# Altium schematic sheet 02_MCU.SchDoc
size A4
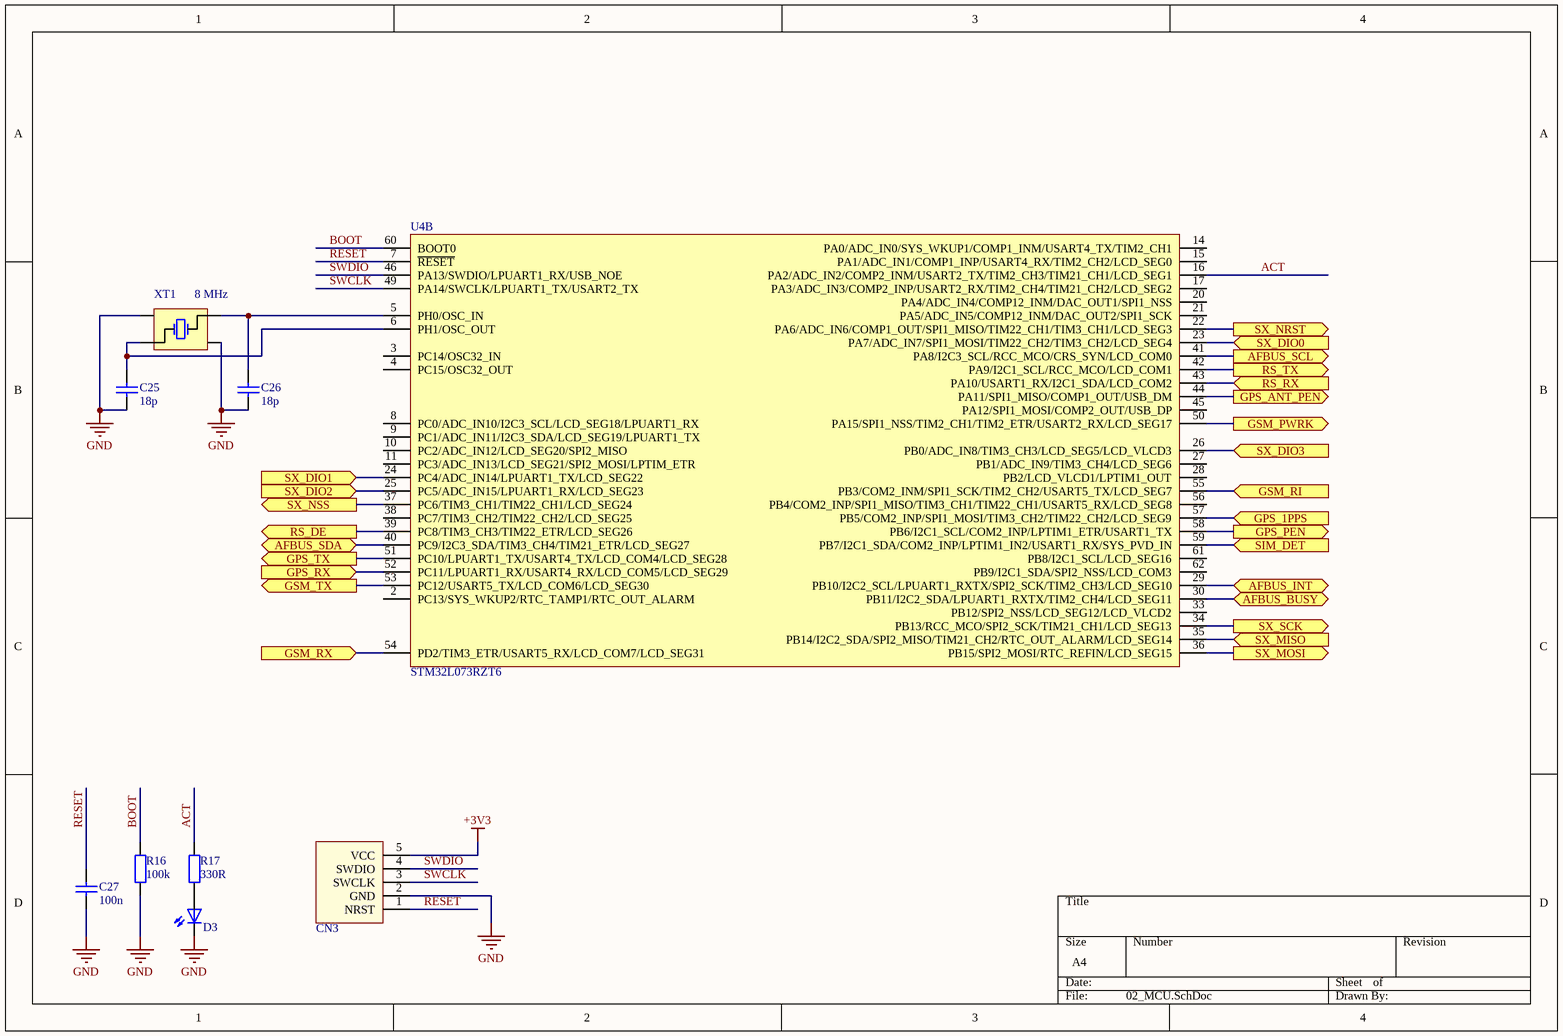
[diagram p0: 02_MCU.SchDoc]

## Parts
C25  18p  [C0603_IPC_MD]
C26  18p  [C0603_IPC_MD]
C27  100n  [C0603_IPC_MD]
CN3  SWD  [SWD_CON_VAR2]  (value not drawn)  (no BOM)
D3  LTST-C190GKT  [LED_0603]  (value not drawn)
R16  100k  [R0603_IPC_MD]
R17  330R  [R0603_IPC_MD]
U4  STM32L073RZT6  [LQFP64_10X10MM]  (part B of 2)
XT1  8 MHz  [5.0X3.2_4PAD_SMT]

## Ports
AFBUS_BUSY (bidir), AFBUS_INT (bidir), AFBUS_SCL (out), AFBUS_SDA (bidir), GPS_1PPS (in), GPS_ANT_PEN (out), GPS_PEN (out), GPS_RX (in), GPS_TX (out), GSM_PWRK (out), GSM_RI (in), GSM_RX (in), GSM_TX (out), RS_DE (out), RS_RX (in), RS_TX (out), SIM_DET (in), SX_DIO0 (in), SX_DIO1 (in), SX_DIO2 (in), SX_DIO3 (in), SX_MISO (in), SX_MOSI (out), SX_NRST (out), SX_NSS (out), SX_SCK (out)

## Nets
+3V3: CN3.5(VCC)
GND: C25.1 C26.1 C27.1 CN3.2(GND) D3.1(C) R16.1 XT1.2(NC) XT1.4(NC)
ACT: R17.1 U4.16(PA2/ADC_IN2/COMP2_INM/USART2_TX/TIM2_CH3/TIM21_CH1/LCD_SEG1)
AFBUS_BUSY: U4.30(PB11/I2C2_SDA/LPUART1_RXTX/TIM2_CH4/LCD_SEG11) ; port AFBUS_BUSY
AFBUS_INT: U4.29(PB10/I2C2_SCL/LPUART1_RXTX/SPI2_SCK/TIM2_CH3/LCD_SEG10) ; port AFBUS_INT
AFBUS_SCL: U4.41(PA8/I2C3_SCL/RCC_MCO/CRS_SYN/LCD_COM0) ; port AFBUS_SCL
AFBUS_SDA: U4.40(PC9/I2C3_SDA/TIM3_CH4/TIM21_ETR/LCD_SEG27) ; port AFBUS_SDA
BOOT: R16.2 U4.60(BOOT0)
GPS_1PPS: U4.57(PB5/COM2_INP/SPI1_MOSI/TIM3_CH2/TIM22_CH2/LCD_SEG9) ; port GPS_1PPS
GPS_ANT_PEN: U4.44(PA11/SPI1_MISO/COMP1_OUT/USB_DM) ; port GPS_ANT_PEN
GPS_PEN: U4.58(PB6/I2C1_SCL/COM2_INP/LPTIM1_ETR/USART1_TX) ; port GPS_PEN
GPS_RX: U4.52(PC11/LPUART1_RX/USART4_RX/LCD_COM5/LCD_SEG29) ; port GPS_RX
GPS_TX: U4.51(PC10/LPUART1_TX/USART4_TX/LCD_COM4/LCD_SEG28) ; port GPS_TX
GSM_PWRK: U4.50(PA15/SPI1_NSS/TIM2_CH1/TIM2_ETR/USART2_RX/LCD_SEG17) ; port GSM_PWRK
GSM_RI: U4.55(PB3/COM2_INM/SPI1_SCK/TIM2_CH2/USART5_TX/LCD_SEG7) ; port GSM_RI
GSM_RX: U4.54(PD2/TIM3_ETR/USART5_RX/LCD_COM7/LCD_SEG31) ; port GSM_RX
GSM_TX: U4.53(PC12/USART5_TX/LCD_COM6/LCD_SEG30) ; port GSM_TX
RESET: C27.2 CN3.1(NRST) U4.7(~{RESET})
RS_DE: U4.39(PC8/TIM3_CH3/TIM22_ETR/LCD_SEG26) ; port RS_DE
RS_RX: U4.43(PA10/USART1_RX/I2C1_SDA/LCD_COM2) ; port RS_RX
RS_TX: U4.42(PA9/I2C1_SCL/RCC_MCO/LCD_COM1) ; port RS_TX
SIM_DET: U4.59(PB7/I2C1_SDA/COM2_INP/LPTIM1_IN2/USART1_RX/SYS_PVD_IN) ; port SIM_DET
SWCLK: CN3.3(SWCLK) U4.49(PA14/SWCLK/LPUART1_TX/USART2_TX)
SWDIO: CN3.4(SWDIO) U4.46(PA13/SWDIO/LPUART1_RX/USB_NOE)
SX_DIO0: U4.23(PA7/ADC_IN7/SPI1_MOSI/TIM22_CH2/TIM3_CH2/LCD_SEG4) ; port SX_DIO0
SX_DIO1: U4.24(PC4/ADC_IN14/LPUART1_TX/LCD_SEG22) ; port SX_DIO1
SX_DIO2: U4.25(PC5/ADC_IN15/LPUART1_RX/LCD_SEG23) ; port SX_DIO2
SX_DIO3: U4.26(PB0/ADC_IN8/TIM3_CH3/LCD_SEG5/LCD_VLCD3) ; port SX_DIO3
SX_MISO: U4.35(PB14/I2C2_SDA/SPI2_MISO/TIM21_CH2/RTC_OUT_ALARM/LCD_SEG14) ; port SX_MISO
SX_MOSI: U4.36(PB15/SPI2_MOSI/RTC_REFIN/LCD_SEG15) ; port SX_MOSI
SX_NRST: U4.22(PA6/ADC_IN6/COMP1_OUT/SPI1_MISO/TIM22_CH1/TIM3_CH1/LCD_SEG3) ; port SX_NRST
SX_NSS: U4.37(PC6/TIM3_CH1/TIM22_CH1/LCD_SEG24) ; port SX_NSS
SX_SCK: U4.34(PB13/RCC_MCO/SPI2_SCK/TIM21_CH1/LCD_SEG13) ; port SX_SCK
NetC25_2: C25.2 U4.6(PH1/OSC_OUT) XT1.1(OSC1)
NetC26_2: C26.2 U4.5(PH0/OSC_IN) XT1.3(OSC2)
NetD3_2: D3.2(A) R17.2

Not connected (* = marked no-connect by the designer): U4 2(PC13/SYS_WKUP2/RTC_TAMP1/RTC_OUT_ALARM) 3(PC14/OSC32_IN) 4(PC15/OSC32_OUT) 8(PC0/ADC_IN10/I2C3_SCL/LCD_SEG18/LPUART1_RX) 9(PC1/ADC_IN11/I2C3_SDA/LCD_SEG19/LPUART1_TX) 10(PC2/ADC_IN12/LCD_SEG20/SPI2_MISO) 11(PC3/ADC_IN13/LCD_SEG21/SPI2_MOSI/LPTIM_ETR) 14(PA0/ADC_IN0/SYS_WKUP1/COMP1_INM/USART4_TX/TIM2_CH1) 15(PA1/ADC_IN1/COMP1_INP/USART4_RX/TIM2_CH2/LCD_SEG0) 17(PA3/ADC_IN3/COMP2_INP/USART2_RX/TIM2_CH4/TIM21_CH2/LCD_SEG2) 20(PA4/ADC_IN4/COMP12_INM/DAC_OUT1/SPI1_NSS) 21(PA5/ADC_IN5/COMP12_INM/DAC_OUT2/SPI1_SCK) 27(PB1/ADC_IN9/TIM3_CH4/LCD_SEG6) 28(PB2/LCD_VLCD1/LPTIM1_OUT) 33(PB12/SPI2_NSS/LCD_SEG12/LCD_VLCD2) 38(PC7/TIM3_CH2/TIM22_CH2/LCD_SEG25) 45(PA12/SPI1_MOSI/COMP2_OUT/USB_DP) 56(PB4/COM2_INP/SPI1_MISO/TIM3_CH1/TIM22_CH1/USART5_RX/LCD_SEG8) 61(PB8/I2C1_SCL/LCD_SEG16) 62(PB9/I2C1_SDA/SPI2_NSS/LCD_COM3)

## Library data of the parts
C25 C26 = CL10C180JB8NNNC: CAP CER 18PF 50V C0G/NP0 0603; Manufacturer: Samsung Electro-Mechanics; Manufacturer Part Number: CL10C180JB8NNNC; Voltage: 50V; Value: 18p; Dielectric: C0G/NP0; Supplier 1: Digi-Key; Supplier Part Number 1: 1276-1089-1-ND
C27 = CL10B104KO8WPNC: CAP CER 0.1UF 16V X7R 0603; Manufacturer: Samsung Electro-Mechanics; Manufacturer Part Number: CL10B104KO8WPNC; Voltage: 16V; Value: 100n; Dielectric: X7R; Supplier 1: Digi-Key; Supplier Part Number 1: 1276-6582-1-ND
CN3 = SWD-CONNECTOR_VAR1: SWDIO SWCLK VDD GND NRST; Manufacturer: *; Manufacturer Part Number: *; Supplier 1: *; Supplier Part Number 1: *
D3 = LTST-C190GKT: LED GREEN CLEAR CHIP SMD 0603; Manufacturer: Lite-On Inc.; Manufacturer Part Number: LTST-C190GKT; Color: Green; Supplier 1: Digi-Key; Supplier Part Number 1: 160-1183-1-ND
R16 = RMCF0603FT100K: RES 100K OHM 1% 1/10W 0603; Manufacturer: Bourns Inc.; Value: 100k; Tolarance: 1%; Manufacturer Part Number: RMCF0603FT100K; Supplier 1: Digi-Key; Supplier Part Number 1: RMCF0603FT100KCT-ND
R17 = CR0603-JW-331ELF: RES SMD 330 OHM 5% 1/10W 0603; Manufacturer: Bourns Inc.; Value: 330R; Tolarance: 5%; Manufacturer Part Number: CR0603-JW-331ELF; Supplier 1: Digi-Key; Supplier Part Number 1: CR0603-JW-331ELFCT-ND
U4 = STM32L073RZT6: Ultra-low-power 32-bit MCU ARM®-based Cortex®-M0+; Manufacturer: ST; SRAM: 20KB; FLASH: 192KB; Manufacturer Part Number: STM32L073RZT6; Supplier 1: Digi-Key; Supplier Part Number 1: 497-16270-ND
XT1 = ABM3B-8.000MHZ-10-1-U-T: 8MHz ±10ppm Crystal 10pF 200 Ohms 4-SMD, No Lead; Manufacturer: Abracon LLC; Manufacturer Part Number: ABM3B-8.000MHZ-10-1-U-T; Type: XTAL; Value: 8 MHz; Supplier 1: Digi-Key; Supplier Part Number 1: 535-9721-1-ND